# Altium schematic sheet IO_SchDoc.SchDoc
size A4
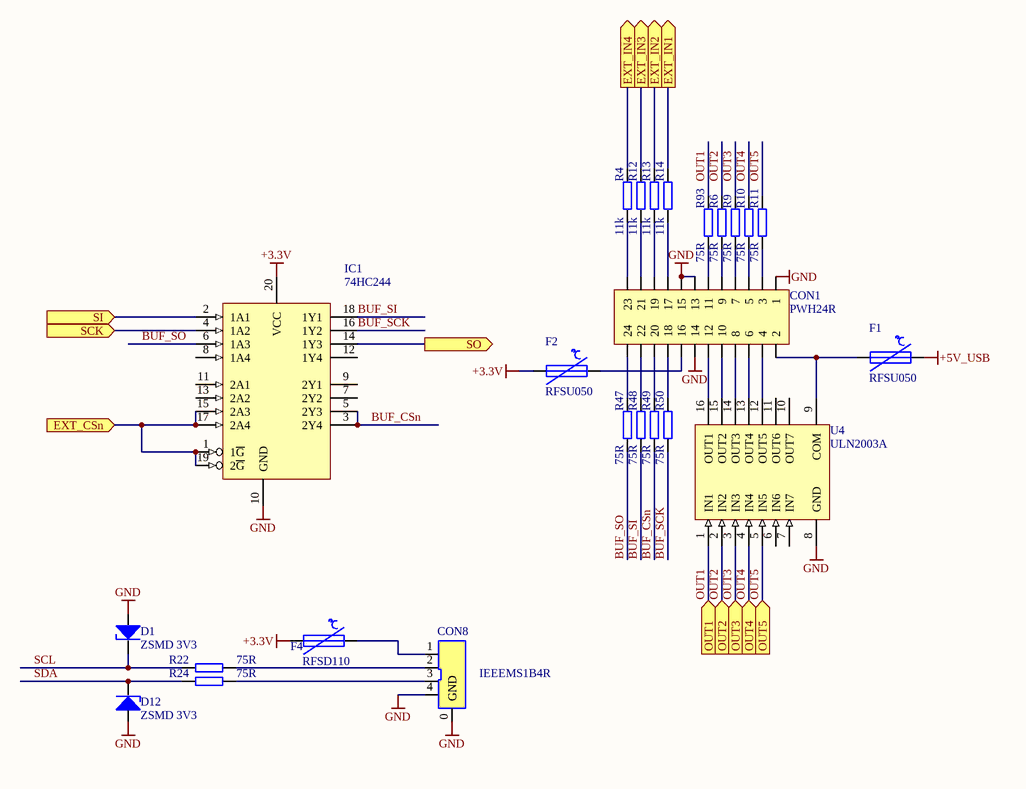
[diagram p0: IO_SchDoc.SchDoc]

## Parts
CON1  PWH24R  [CON_PWH24R-LF]
CON8  IEEEMS1B4R  [CON_IEEEMS1B4R]
D1  ZSMD 3V3  [SOD80]
D12  ZSMD 3V3  [SOD80]
F1  RFSU050  [PTC_SMD_1812]
F2  RFSU050  [PTC_SMD_1812]
F4  RFSD110  [PTC_SMD_1812]
IC1  74HC244  [tssop20]
R4  11k  [0603]
R6  75R  [0603]
R9  75R  [0603]
R10  75R  [0603]
R11  75R  [0603]
R12  11k  [0603]
R13  11k  [0603]
R14  11k  [0603]
R22  75R  [0603]
R24  75R  [0603]
R47  75R  [0603]
R48  75R  [0603]
R49  75R  [0603]
R50  75R  [0603]
R93  75R  [0603]
U4  ULN2003A  [So-16]

## Ports
EXT_CSn (in), EXT_IN1 (out), EXT_IN2 (out), EXT_IN3 (out), EXT_IN4 (out), OUT1 (in), OUT2 (in), OUT3 (in), OUT4 (in), OUT5 (in), SCK (in), SI (in), SO (out)

## Nets
+3.3V: F2.1 F4.1 IC1.20(VCC)
+5V_USB: F1.2
GND: CON1.1 CON1.13 CON1.14 CON1.15 CON8.0(GND) CON8.4 D1.A D12.A IC1.10(GND) U4.8(GND)
BUF_CSn: IC1.3(2Y4) IC1.5(2Y3) R49.2
BUF_SCK: IC1.16(1Y2) R50.2
BUF_SI: IC1.18(1Y1) R48.2
BUF_SO: IC1.6(1A3) R47.2
EXT_CSn: IC1.1(1~{G}) IC1.15(2A3) IC1.17(2A4) IC1.19(2~{G}) ; port EXT_CSn
EXT_IN1: R14.1 ; port EXT_IN1
EXT_IN2: R13.1 ; port EXT_IN2
EXT_IN3: R12.1 ; port EXT_IN3
EXT_IN4: R4.1 ; port EXT_IN4
OUT1: R93.2 U4.1(IN1) ; port OUT1
OUT2: R6.2 U4.2(IN2) ; port OUT2
OUT3: R9.2 U4.3(IN3) ; port OUT3
OUT4: R10.2 U4.4(IN4) ; port OUT4
OUT5: R11.2 U4.5(IN5) ; port OUT5
SCK: IC1.4(1A2) ; port SCK
SCL: D1.K R22.1
SDA: D12.K R24.1
SI: IC1.2(1A1) ; port SI
SO: IC1.14(1Y3) ; port SO
NetCON1_2: CON1.2 F1.1 U4.9(COM)
NetCON1_3: CON1.3 R11.1
NetCON1_4: CON1.4 U4.12(OUT5)
NetCON1_5: CON1.5 R10.1
NetCON1_6: CON1.6 U4.13(OUT4)
NetCON1_7: CON1.7 R9.1
NetCON1_8: CON1.8 U4.14(OUT3)
NetCON1_9: CON1.9 R6.1
NetCON1_10: CON1.10 U4.15(OUT2)
NetCON1_11: CON1.11 R93.1
NetCON1_12: CON1.12 U4.16(OUT1)
NetCON1_16: CON1.16 F2.2
NetCON1_17: CON1.17 R14.2
NetCON1_18: CON1.18 R50.1
NetCON1_19: CON1.19 R13.2
NetCON1_20: CON1.20 R49.1
NetCON1_21: CON1.21 R12.2
NetCON1_22: CON1.22 R48.1
NetCON1_23: CON1.23 R4.2
NetCON1_24: CON1.24 R47.1
NetCON8_1: CON8.1 F4.2
NetCON8_2: CON8.2 R22.2
NetCON8_3: CON8.3 R24.2

Not connected (* = marked no-connect by the designer): IC1 7(2Y2) 8(1A4) 9(2Y1) 11(2A1) 12(1Y4) 13(2A2); U4 6(IN6) 7(IN7) 10(OUT7) 11(OUT6)

## Library data of the parts
CON1 = CON_crimp_24p_RA_TH_3mm: 3mm crimped terminal (Maritex)
CON8 = CON_USB_mini: CON_IEEE1394_mini
D1 D12 = D_ZENER: Zener Diode
F1 F2 = F_POLYSWITCH: polymer FUSE
F4 = F_POLYSWITCH: polymer FUSE (Maritex)
IC1 = 74HC244: TTL BUS tristate
R4 R6 R9-R14 R22 R24 R47-R50 R93 = RES_SMD: SMD Resistor
U4 = DRV_ULN2003A: High-Voltage, High-Current Darlington Array; Package Information: Latest Revision: 1998; Code - JEDEC: MS-001-BB; Published: 13-Oct-2000; Revision: 17-Jul-2002: Re-released for DXP Platform.; Datasheet: Latest Revision: 1998; Package Reference: A16; Publisher: Altium Limited